# Altium schematic sheet ExternalConnectors.SchDoc
size A4; SheetNumber: 8; SheetTotal: 12
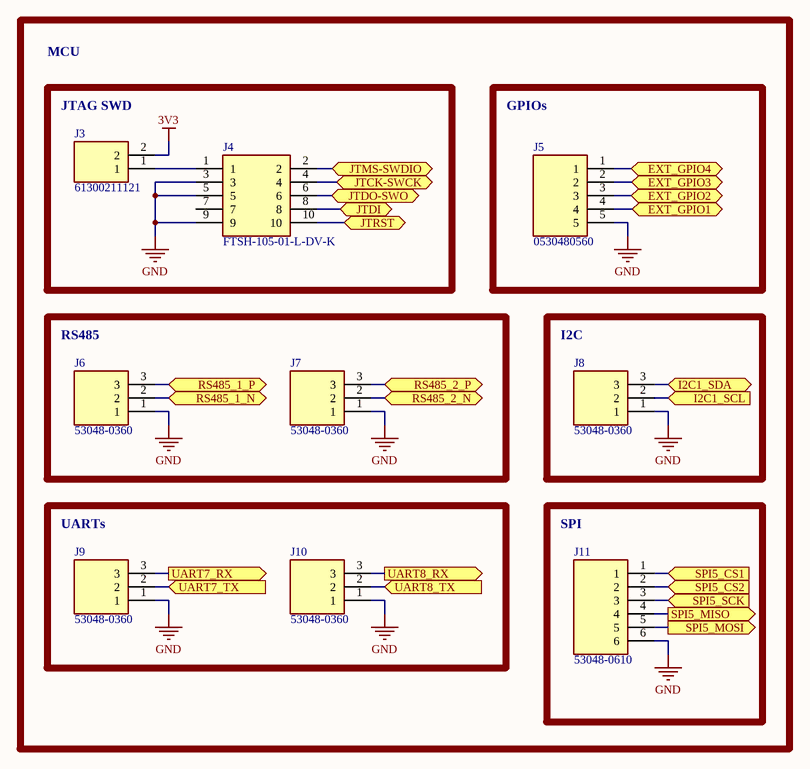
[diagram p0: ExternalConnectors.SchDoc]

## Parts
J3  61300211121  [HDRV2W110P0X254_1X2_508X254X854P]
J4  FTSH-105-01-L-DV-K  [FTSH10501LDVK]
J5  0530480560  [530480510]
J6  53048-0360  [SHDRRA3W35P0X125_1X3_550X550X350P]
J7  53048-0360  [SHDRRA3W35P0X125_1X3_550X550X350P]
J8  53048-0360  [SHDRRA3W35P0X125_1X3_550X550X350P]
J9  53048-0360  [SHDRRA3W35P0X125_1X3_550X550X350P]
J10  53048-0360  [SHDRRA3W35P0X125_1X3_550X550X350P]
J11  53048-0610  [530480610]

## Blocks framed on the sheet
JTAG SWD: J3 J4
GPIOs: J5
RS485: J6 J7
I2C: J8
UARTs: J9 J10
SPI: J11

## Ports
EXT_GPIO1 (bidir), EXT_GPIO2 (bidir), EXT_GPIO3 (bidir), EXT_GPIO4 (bidir), I2C1_SCL (in), I2C1_SDA (bidir), JTCK-SWCK (bidir), JTDI (bidir), JTDO-SWO (bidir), JTMS-SWDIO (bidir), JTRST (bidir), RS485_1_N (bidir), RS485_1_P (bidir), RS485_2_N (bidir), RS485_2_P (bidir), SPI5_CS1 (in), SPI5_CS2 (in), SPI5_MISO (out), SPI5_MOSI (out), SPI5_SCK (in), UART7_RX (out), UART7_TX (in), UART8_RX (out), UART8_TX (in)

## Nets
3V3: J3.2
GND: J4.3 J4.5 J4.9 J5.5 J6.1 J7.1 J8.1 J9.1 J10.1 J11.6
EXT_GPIO1: J5.4 ; port EXT_GPIO1
EXT_GPIO2: J5.3 ; port EXT_GPIO2
EXT_GPIO3: J5.2 ; port EXT_GPIO3
EXT_GPIO4: J5.1 ; port EXT_GPIO4
I2C1_SCL: J8.2 ; port I2C1_SCL
I2C1_SDA: J8.3 ; port I2C1_SDA
JTCK-SWCK: J4.4 ; port JTCK-SWCK
JTDI: J4.8 ; port JTDI
JTDO-SWO: J4.6 ; port JTDO-SWO
JTMS-SWDIO: J4.2 ; port JTMS-SWDIO
JTRST: J4.10 ; port JTRST
RS485_1_N: J6.2 ; port RS485_1_N
RS485_1_P: J6.3 ; port RS485_1_P
RS485_2_N: J7.2 ; port RS485_2_N
RS485_2_P: J7.3 ; port RS485_2_P
SPI5_CS1: J11.1 ; port SPI5_CS1
SPI5_CS2: J11.2 ; port SPI5_CS2
SPI5_MISO: J11.4 ; port SPI5_MISO
SPI5_MOSI: J11.5 ; port SPI5_MOSI
SPI5_SCK: J11.3 ; port SPI5_SCK
UART7_RX: J9.3 ; port UART7_RX
UART7_TX: J9.2 ; port UART7_TX
UART8_RX: J10.3 ; port UART8_RX
UART8_TX: J10.2 ; port UART8_TX
NetJ3_1: J3.1 J4.1

Not connected (* = marked no-connect by the designer): J4 7

## Notes on the sheet
- MCU

## Library data of the parts
J3 = 61300211121: Connector; Manufacturer_Name: Wurth Elektronik; Datasheet Link: https://componentsearchengine.com/Datasheets/2/61300211121.pdf; Height: 8.54mm; Manufacturer_Part_Number: 61300211121; Mouser Part Number: 710-61300211121; Mouser Price/Stock: https://www.mouser.co.uk/ProductDetail/Wurth-Elektronik/61300211121?qs=t4813l51qx%252B1A5GYDQxPlw%3D%3D
J4 = FTSH-105-01-L-DV-K: Connector Header Surface Mount 10 position 0.050" (1.27mm); pin to pad: 1>10 2>9 3>8 4>7 5>6 6>5 7>4 8>3 9>2 10>1; Manufacturer_Name: SAMTEC; Datasheet Link: https://www.arrow.com/en/products/ftsh-105-01-l-dv-k/samtec; Height: 6.1mm; Manufacturer_Part_Number: FTSH-105-01-L-DV-K; Mouser Part Number: 200-FTSH10501LDVK; Mouser Price/Stock: https://www.mouser.co.uk/ProductDetail/Samtec/FTSH-105-01-L-DV-K?qs=%252B5JSS813miOqo3Vy%252BvhCFg%3D%3D; Arrow Part Number: FTSH-105-01-L-DV-K; Arrow Price/Stock: https://www.arrow.com/en/products/ftsh-105-01-l-dv-k/samtec?region=europe
J5 = 53048-0510: Connector Header Through Hole, Right Angle 5 position 0.049" (1.25mm); Manufacturer_Name: Molex; Datasheet Link: https://componentsearchengine.com/Datasheets/2/53048-0510.pdf; Height: 3.7mm; Manufacturer_Part_Number: 53048-0510; Mouser Part Number: 538-53048-0510; Mouser Price/Stock: https://www.mouser.co.uk/ProductDetail/Molex/53048-0510?qs=nn26K2WaEYvXrn%2FdgEEqtg%3D%3D
J6-J10 = 53048-0310: Connector Header Through Hole, Right Angle 3 position 0.049" (1.25mm); Manufacturer_Name: Molex; Datasheet Link: https://www.molex.com/pdm_docs/sd/530481010_sd.pdf; Height: 3.5mm; Manufacturer_Part_Number: 53048-0310; Mouser Part Number: 538-53048-0310; Mouser Price/Stock: https://www.mouser.co.uk/ProductDetail/Molex/53048-0310?qs=zXrbR4Jv0OfUlEeVnlaifA%3D%3D
J11 = 53048-0610: Connector; Manufacturer_Name: Molex; Datasheet Link: https://www.molex.com/pdm_docs/sd/530480610_sd.pdf; Height: 3.7mm; Manufacturer_Part_Number: 53048-0610; Mouser Part Number: 538-53048-0610; Mouser Price/Stock: https://www.mouser.co.uk/ProductDetail/Molex/53048-0610?qs=4XSMV6Twtb0hBXTOEHM3BQ%3D%3D; Arrow Part Number: 53048-0610; Arrow Price/Stock: https://www.arrow.com/en/products/53048-0610/molex?region=nac